# Altium project MDBU017A.PrjPcb (part 1 of 2)
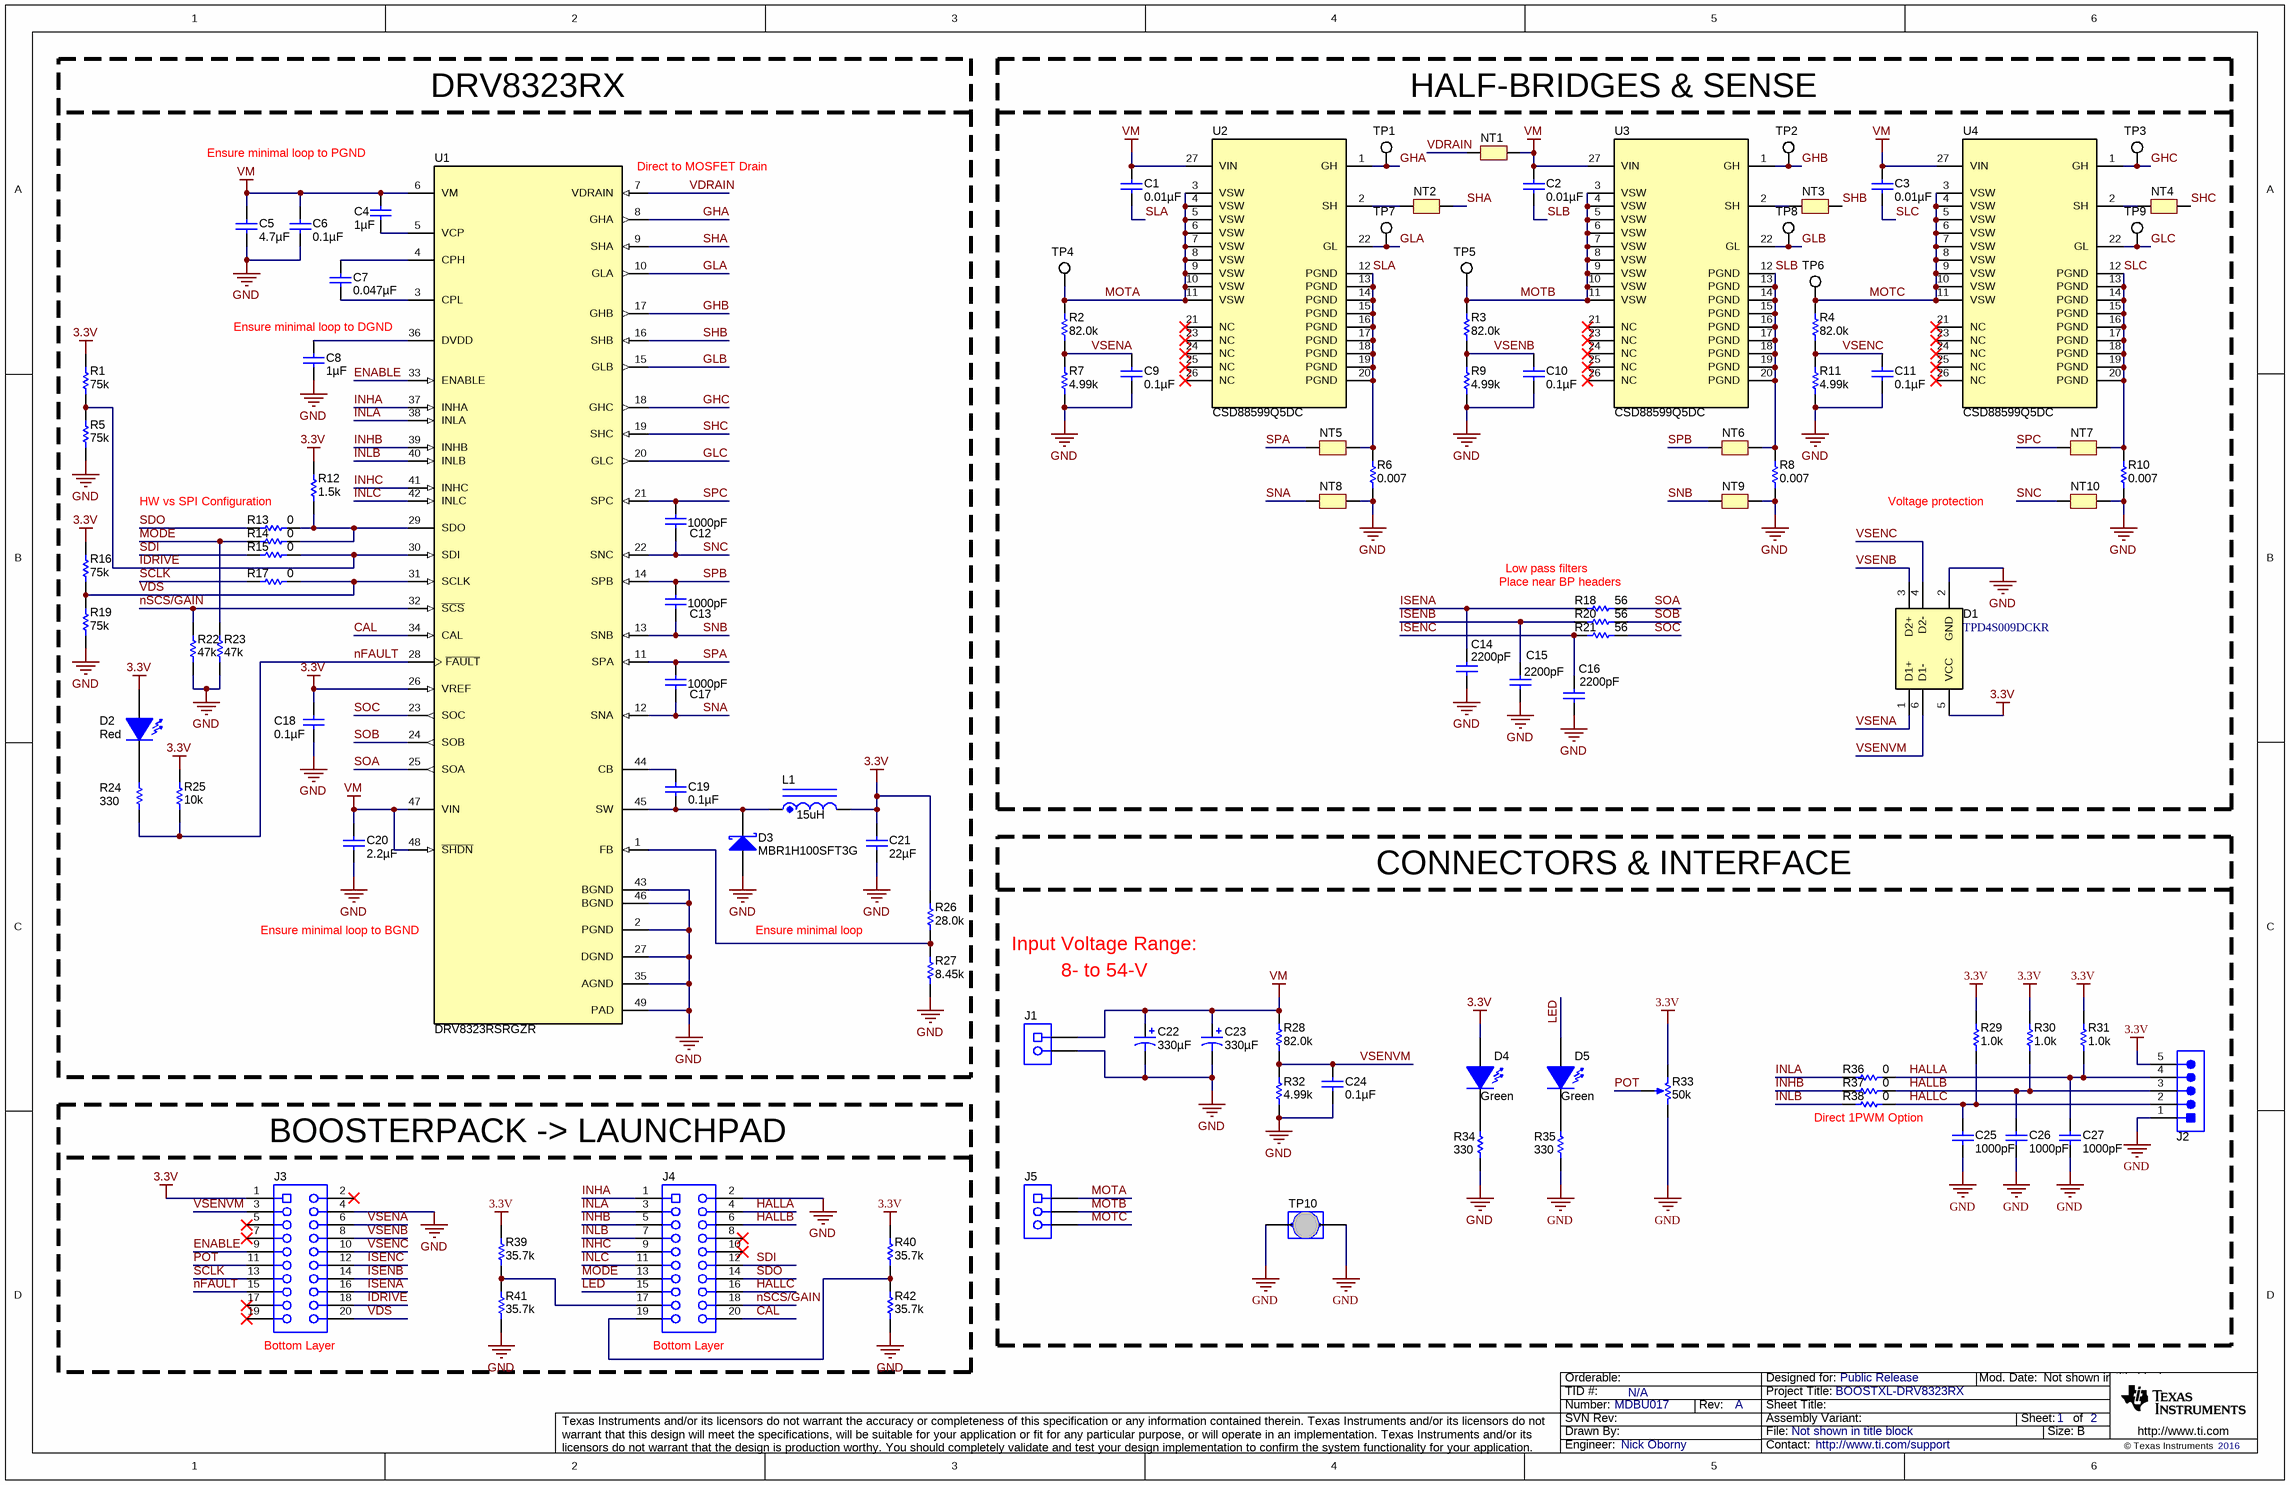
[diagram p0: MDBU017A.SchDoc]
CopyrightYear: 2016; PCB_Layout: Nick Oborny; PCB_Rev: A; PRJ_Customer: Public Release; PRJ_Engineer: Nick Oborny; PRJ_Number: MDBU017; PRJ_Title: BOOSTXL-DRV8323RX; SCH_Rev: A; TechSupport: http://www.ti.com/support; TID: N/A
2 sheets, 117 parts. Net scope: global (net labels, ports and power ports of the same name join across sheets).
Board file: MDBU017A.PcbDoc
Sheets:
  MDBU017A.SchDoc
  MDBU017A_Hardware.SchDoc

## Sheet MDBU017A.SchDoc
size 431 x 279 mm; Date: Not shown in title block; ApprovedBy: Not shown in title block; CheckedBy: Not shown in title block; Author: Not shown in title block; CompanyName: Not shown in title block; Engineer: Not shown in title block; Organization: Not shown in title block; Address1: Not shown in title block; Address2: Not shown in title block; Address3: Not shown in title block; Address4: Not shown in title block; DocumentNumber: 1; Revision: Use project parameter SCH_Rev; SheetNumber: 1; SheetTotal: 2; PageSetup: Record=PageOptions|CenterHorizontal=True|CenterVertical=True|PrintScale=1.00|XCorrection=1.00|YCorrection=1.00|PrintKind=0|BorderSize=5000000|LeftOffset=0|BottomOffset=0|Orientation=2|PaperLength=1000|PaperWidth=1000|Scale=100|PaperSource=15|PrintQuality=600|MediaType=1|DitherType=10|PaperKind=Letter|PrintScaleMode=1; CurrentTime: Not shown in title block; CurrentDate: Not shown in title block; Time: Not shown in title block; DocumentFullPathAndName: Not shown in title block; DocumentName: Not shown in title block; ModifiedDate: Not shown in title block; ImagePath: Not shown in title block

### Parts
C1  ValueDisplayed: 0.01µF  [0603L]  (hidden comment: C0603C103K1RACTU)
C2  ValueDisplayed: 0.01µF  [0603L]  (hidden comment: C0603C103K1RACTU)
C3  ValueDisplayed: 0.01µF  [0603L]  (hidden comment: C0603C103K1RACTU)
C4  ValueDisplayed: 1µF  [0603L]  (hidden comment: 885012206052)
C5  ValueDisplayed: 4.7µF  [1210_270L]  (hidden comment: GRM32ER71K475KE14L)
C6  ValueDisplayed: 0.1µF  [0603L]  (hidden comment: GRM188R72A104KA35D)
C7  ValueDisplayed: 0.047µF  [0603L]  (hidden comment: C1608X7S2A473K080AB)
C8  ValueDisplayed: 1µF  [0603L]  (hidden comment: GRM188R70J105KA01D)
C9  ValueDisplayed: 0.1µF  [0603L]  (hidden comment: C0603C104J4RACTU)
C10  ValueDisplayed: 0.1µF  [0603L]  (hidden comment: C0603C104J4RACTU)
C11  ValueDisplayed: 0.1µF  [0603L]  (hidden comment: C0603C104J4RACTU)
C12  ValueDisplayed: 1000pF  [0603L]  (hidden comment: GRM188R71C102KA01D)
C13  ValueDisplayed: 1000pF  [0603L]  (hidden comment: GRM188R71C102KA01D)
C14  ValueDisplayed: 2200pF  [0603L]  (hidden comment: GRM188R71C222KA01D)
C15  ValueDisplayed: 2200pF  [0603L]  (hidden comment: GRM188R71C222KA01D)
C16  ValueDisplayed: 2200pF  [0603L]  (hidden comment: GRM188R71C222KA01D)
C17  ValueDisplayed: 1000pF  [0603L]  (hidden comment: GRM188R71C102KA01D)
C18  ValueDisplayed: 0.1µF  [0603L]  (hidden comment: GRM188R70J104KA01D)
C19  ValueDisplayed: 0.1µF  [0603L]  (hidden comment: 0603YC104JAT2A)
C20  ValueDisplayed: 2.2µF  [1210L]  (hidden comment: HMK325B7225KN-T)
C21  ValueDisplayed: 22µF  [1206_180L]  (hidden comment: C3216X7S1A226M160AC)
C22  ValueDisplayed: 330µF  [CAPSMT_62_KG5]  (hidden comment: EMVA630ADA331MKG5S)
C23  ValueDisplayed: 330µF  [CAPSMT_62_KG5]  (hidden comment: EMVA630ADA331MKG5S)
C24  ValueDisplayed: 0.1µF  [0603L]  (hidden comment: C0603C104J4RACTU)
C25  ValueDisplayed: 1000pF  [0603L]  (hidden comment: 885012206034)
C26  ValueDisplayed: 1000pF  [0603L]  (hidden comment: 885012206034)
C27  ValueDisplayed: 1000pF  [0603L]  (hidden comment: 885012206034)
D1  TPD4S009DCKR  [DCK0006A_L]
D2  value Red  [LED_LTST-C170]  (hidden comment: LTST-C170KRKT)
D3  MBR1H100SFT3G  [SOD-123FL]
D4  value Green  [LED_LTST-C171]  (hidden comment: LTST-C171GKT)
D5  value Green  [LED_LTST-C171]  (hidden comment: LTST-C171GKT)
J1  691 101 710 002  [Wurth_691101710002]  (value not drawn)
J2  PEC05SAAN  [Sullins_PxC05SAAN]  (value not drawn)
J3  SSQ-110-03-G-D  [Samtec_SSQ-110-03-x-D]  (value not drawn)
J4  SSQ-110-03-G-D  [Samtec_SSQ-110-03-x-D]  (value not drawn)
J5  691 101 710 003  [Wurth_691101710003]  (value not drawn)
L1  value 15uH  [SD53]  (hidden comment: SD53-150-R)
NT1  Net-Tie  [Net-Tie_10mil]  (value not drawn)  (net tie, no BOM)
NT2  Net-Tie  [Net-Tie_10mil]  (value not drawn)  (net tie, no BOM)
NT3  Net-Tie  [Net-Tie_10mil]  (value not drawn)  (net tie, no BOM)
NT4  Net-Tie  [Net-Tie_10mil]  (value not drawn)  (net tie, no BOM)
NT5  Net-Tie  [Net-Tie_10mil]  (value not drawn)  (net tie, no BOM)
NT6  Net-Tie  [Net-Tie_10mil]  (value not drawn)  (net tie, no BOM)
NT7  Net-Tie  [Net-Tie_10mil]  (value not drawn)  (net tie, no BOM)
NT8  Net-Tie  [Net-Tie_10mil]  (value not drawn)  (net tie, no BOM)
NT9  Net-Tie  [Net-Tie_10mil]  (value not drawn)  (net tie, no BOM)
NT10  Net-Tie  [Net-Tie_10mil]  (value not drawn)  (net tie, no BOM)
R1  ValueDisplayed: 75k  [0603L]  (hidden comment: CRCW060375K0JNEA)
R2  ValueDisplayed: 82.0k  [0603L]  (hidden comment: RC0603FR-0782KL)
R3  ValueDisplayed: 82.0k  [0603L]  (hidden comment: RC0603FR-0782KL)
R4  ValueDisplayed: 82.0k  [0603L]  (hidden comment: RC0603FR-0782KL)
R5  ValueDisplayed: 75k  [0603L]  (hidden comment: CRCW060375K0JNEA)
R6  ValueDisplayed: 0.007  [2512L]  (hidden comment: CRE2512-FZ-R007E-3)
R7  ValueDisplayed: 4.99k  [0603L]  (hidden comment: RC0603FR-074K99L)
R8  ValueDisplayed: 0.007  [2512L]  (hidden comment: CRE2512-FZ-R007E-3)
R9  ValueDisplayed: 4.99k  [0603L]  (hidden comment: RC0603FR-074K99L)
R10  ValueDisplayed: 0.007  [2512L]  (hidden comment: CRE2512-FZ-R007E-3)
R11  ValueDisplayed: 4.99k  [0603L]  (hidden comment: RC0603FR-074K99L)
R12  ValueDisplayed: 1.5k  [0603L]  (hidden comment: CRCW06031K50JNEA)
R13  value 0  [0603L]  (hidden comment: CRCW06030000Z0EA)
R14  value 0  [0603L]  (hidden comment: CRCW06030000Z0EA)
R15  value 0  [0603L]  (hidden comment: CRCW06030000Z0EA)
R16  ValueDisplayed: 75k  [0603L]  (hidden comment: CRCW060375K0JNEA)
R17  value 0  [0603L]  (hidden comment: CRCW06030000Z0EA)
R18  value 56  [0603L]  (hidden comment: CRCW060356R0JNEA)
R19  ValueDisplayed: 75k  [0603L]  (hidden comment: CRCW060375K0JNEA)
R20  value 56  [0603L]  (hidden comment: CRCW060356R0JNEA)
R21  value 56  [0603L]  (hidden comment: CRCW060356R0JNEA)
R22  ValueDisplayed: 47k  [0603L]  (hidden comment: CRCW060347K0JNEA)
R23  ValueDisplayed: 47k  [0603L]  (hidden comment: CRCW060347K0JNEA)
R24  value 330  [0603L]  (hidden comment: CRCW0603330RJNEA)
R25  ValueDisplayed: 10k  [0603L]  (hidden comment: CRCW060310K0JNEA)
R26  ValueDisplayed: 28.0k  [0603L]  (hidden comment: CRCW060328K0FKEA)
R27  ValueDisplayed: 8.45k  [0603L]  (hidden comment: CRCW06038K45FKEA)
R28  ValueDisplayed: 82.0k  [0603L]  (hidden comment: RC0603FR-0782KL)
R29  ValueDisplayed: 1.0k  [0603L]  (hidden comment: CRCW06031K00JNEA)
R30  ValueDisplayed: 1.0k  [0603L]  (hidden comment: CRCW06031K00JNEA)
R31  ValueDisplayed: 1.0k  [0603L]  (hidden comment: CRCW06031K00JNEA)
R32  ValueDisplayed: 4.99k  [0603L]  (hidden comment: RC0603FR-074K99L)
R33  value 50k  [Bourns_3352T]  (hidden comment: 3352T-1-503LF)
R34  value 330  [0603L]  (hidden comment: CRCW0603330RJNEA)
R35  value 330  [0603L]  (hidden comment: CRCW0603330RJNEA)
R36  value 0  [0603L]  (hidden comment: CRCW06030000Z0EA)
R37  value 0  [0603L]  (hidden comment: CRCW06030000Z0EA)
R38  value 0  [0603L]  (hidden comment: CRCW06030000Z0EA)
R39  ValueDisplayed: 35.7k  [0603L]  (hidden comment: RC0603FR-0735K7L)
R40  ValueDisplayed: 35.7k  [0603L]  (hidden comment: RC0603FR-0735K7L)
R41  ValueDisplayed: 35.7k  [0603L]  (hidden comment: RC0603FR-0735K7L)
R42  ValueDisplayed: 35.7k  [0603L]  (hidden comment: RC0603FR-0735K7L)
TP1  5002  [Keystone5002]  (value not drawn)
TP2  5002  [Keystone5002]  (value not drawn)
TP3  5002  [Keystone5002]  (value not drawn)
TP4  5002  [Keystone5002]  (value not drawn)
TP5  5002  [Keystone5002]  (value not drawn)
TP6  5002  [Keystone5002]  (value not drawn)
TP7  5002  [Keystone5002]  (value not drawn)
TP8  5002  [Keystone5002]  (value not drawn)
TP9  5002  [Keystone5002]  (value not drawn)
TP10  D3082-05  [Harwin_D3082-05]  (value not drawn)
U1  DRV8323RSRGZR  [RGZ0048B]
U2  CSD88599Q5DC  [DMM0022A]
U3  CSD88599Q5DC  [DMM0022A]
U4  CSD88599Q5DC  [DMM0022A]

### Blocks framed on the sheet
DRV8323RX: C4-C8 C12 C13 C17-C21 D2 D3 L1 R1 R5 R12-R17 R19 R22-R27 U1
HALF-BRIDGES & SENSE: C1-C3 C9-C11 C14-C16 D1 NT1-NT10 R2-R4 R6-R11 R18 R20 R21 TP1-TP9 U2-U4
CONNECTORS & INTERFACE: C22-C27 D4 D5 J1 J2 J5 R28-R38 TP10
BOOSTERPACK -> LAUNCHPAD: J3 J4 R39-R42

### Nets
3.3V: C18.1 C21.1 D1.5(VCC) D2.1(A) D4.1(A) J2.5 J3.1 L1.2 R1.2 R12.2 R16.2 R25.2 R26.2 R29.2 R30.2 R31.2 R33.3(CW) R39.2 R40.2 U1.26(VREF)
GND: C5.2 C6.2 C8.2 C9.2 C10.2 C11.2 C14.2 C15.2 C16.2 C18.2 C20.2 C21.2 C22.2(-) C23.2(-) C24.2 C25.2 C26.2 C27.2 D1.2(GND) D3.2(A) J1.2 J2.1 J3.4 J4.2 NT8.2 NT9.2 NT10.2 R5.1 R6.1 R7.1 R8.1 R9.1 R10.1 R11.1 R19.1 R22.1 R23.1 R27.1 R32.1 R33.1(CCW) R34.1 R35.1 R41.1 R42.1 TP10.1 TP10.2 U1.2(PGND) U1.27(DGND) U1.35(AGND) U1.43(BGND) U1.46(BGND) U1.49(PAD)
VM: C1.1 C2.1 C3.1 C4.1 C5.1 C6.1 C20.1 C22.1(+) C23.1(+) J1.1 NT1.2 R28.2 U1.6(VM) U1.47(VIN) U1.48(~{SHDN}) U2.27(VIN) U3.27(VIN) U4.27(VIN)
CAL: J4.20 U1.34(CAL)
ENABLE: J3.9 U1.33(ENABLE)
GHA: TP1.1 U1.8(GHA) U2.1(GH)
GHB: TP2.1 U1.17(GHB) U3.1(GH)
GHC: TP3.1 U1.18(GHC) U4.1(GH)
GLA: TP7.1 U1.10(GLA) U2.22(GL)
GLB: TP8.1 U1.15(GLB) U3.22(GL)
GLC: TP9.1 U1.20(GLC) U4.22(GL)
HALLA: C27.1 J2.4 J4.4 R31.1 R36.1
HALLB: C26.1 J2.3 J4.6 R30.1 R37.1
HALLC: C25.1 J2.2 J4.16 R29.1 R38.1
IDRIVE: J3.18 R1.1 R5.2 R15.1 U1.30(SDI)
INHA: J4.1 U1.37(INHA)
INHB: J4.5 R37.2 U1.39(INHB)
INHC: J4.9 U1.41(INHC)
INLA: J4.3 R36.2 U1.38(INLA)
INLB: J4.7 R38.2 U1.40(INLB)
INLC: J4.11 U1.42(INLC)
ISENA: C14.1 J3.16 R18.1
ISENB: C15.1 J3.14 R20.1
ISENC: C16.1 J3.12 R21.1
LED: D5.1(A) J4.15
MODE: J4.13 R14.2 R23.2
MOTA: J5.1 R2.2 TP4.1 U2.3(VSW) U2.4(VSW) U2.5(VSW) U2.6(VSW) U2.7(VSW) U2.8(VSW) U2.9(VSW) U2.10(VSW) U2.11(VSW)
MOTB: J5.2 R3.2 TP5.1 U3.3(VSW) U3.4(VSW) U3.5(VSW) U3.6(VSW) U3.7(VSW) U3.8(VSW) U3.9(VSW) U3.10(VSW) U3.11(VSW)
MOTC: J5.3 R4.2 TP6.1 U4.3(VSW) U4.4(VSW) U4.5(VSW) U4.6(VSW) U4.7(VSW) U4.8(VSW) U4.9(VSW) U4.10(VSW) U4.11(VSW)
nFAULT: J3.15 R24.1 R25.1 U1.28(~{FAULT})
nSCS/GAIN: J4.18 R22.2 U1.32(~{SCS})
POT: J3.11 R33.2(WIPER)
SCLK: J3.13 R17.2
SDI: J4.12 R15.2
SDO: J4.14 R13.2
SHA: NT2.2 U1.9(SHA)
SHB: NT3.2 U1.16(SHB)
SHC: NT4.2 U1.19(SHC)
SLA: C1.2 NT5.2 R6.2 U2.12(PGND) U2.13(PGND) U2.14(PGND) U2.15(PGND) U2.16(PGND) U2.17(PGND) U2.18(PGND) U2.19(PGND) U2.20(PGND)
SLB: C2.2 NT6.2 R8.2 U3.12(PGND) U3.13(PGND) U3.14(PGND) U3.15(PGND) U3.16(PGND) U3.17(PGND) U3.18(PGND) U3.19(PGND) U3.20(PGND)
SLC: C3.2 NT7.2 R10.2 U4.12(PGND) U4.13(PGND) U4.14(PGND) U4.15(PGND) U4.16(PGND) U4.17(PGND) U4.18(PGND) U4.19(PGND) U4.20(PGND)
SNA: C17.2 NT8.1 U1.12(SNA)
SNB: C13.2 NT9.1 U1.13(SNB)
SNC: C12.2 NT10.1 U1.22(SNC)
SOA: R18.2 U1.25(SOA)
SOB: R20.2 U1.24(SOB)
SOC: R21.2 U1.23(SOC)
SPA: C17.1 NT5.1 U1.11(SPA)
SPB: C13.1 NT6.1 U1.14(SPB)
SPC: C12.1 NT7.1 U1.21(SPC)
VDRAIN: NT1.1 U1.7(VDRAIN)
VDS: J3.20 R16.1 R17.1 R19.2 U1.31(SCLK)
VSENA: C9.1 D1.1(D1+) J3.6 R2.1 R7.2
VSENB: C10.1 D1.3(D2+) J3.8 R3.1 R9.2
VSENC: C11.1 D1.4(D2-) J3.10 R4.1 R11.2
VSENVM: C24.1 D1.6(D1-) J3.3 R28.1 R32.2
NetC4_2: C4.2 U1.5(VCP)
NetC7_1: C7.1 U1.4(CPH)
NetC7_2: C7.2 U1.3(CPL)
NetC8_1: C8.1 U1.36(DVDD)
NetC19_1: C19.1 U1.44(CB)
NetC19_2: C19.2 D3.1(K) L1.1 U1.45(SW)
NetD2_2: D2.2(K) R24.2
NetD4_2: D4.2(K) R34.2
NetD5_2: D5.2(K) R35.2
NetJ4_17: J4.17 R39.1 R41.2
NetJ4_19: J4.19 R40.1 R42.2
NetNT2_1: NT2.1 U2.2(SH)
NetNT3_1: NT3.1 U3.2(SH)
NetNT4_1: NT4.1 U4.2(SH)
NetR12_1: R12.1 R13.1 R14.1 U1.29(SDO)
NetR26_1: R26.1 R27.2 U1.1(FB)

Not connected (* = marked no-connect by the designer): J3 2* 5* 7* 17* 19*; J4 8* 10*; U2 21(NC)* 23(NC)* 24(NC)* 25(NC)* 26(NC)*; U3 21(NC)* 23(NC)* 24(NC)* 25(NC)* 26(NC)*; U4 21(NC)* 23(NC)* 24(NC)* 25(NC)* 26(NC)*

### Notes on the sheet
- Ensure minimal loop to PGND
- (near U1) Direct to MOSFET Drain
- Ensure minimal loop to DGND
- HW vs SPI Configuration
- Voltage protection
- Low pass filters
- Place near BP headers
- (near U1) Ensure minimal loop to BGND
- Ensure minimal loop
- Input Voltage Range:
- 8- to 54-V
- (near R38) Direct 1PWM Option
- (near J3) Bottom Layer
- (near J4) Bottom Layer
- Drawn By:
- SVN Rev:
- Number:
- TID #:
- Orderable:
- Rev:
- Sheet Title:
- File:
- Project Title:
- Designed for:
- Assembly Variant:
- Mod. Date:
- Sheet:
- Size:
- of
- B
- http://www.ti.com
- Texas Instruments and/or its licensors do not warrant the accuracy or completeness of this specification or any information contained therein. Texas Instruments and/or its licensors do not warrant that this design will meet the specifications, will be suitable for your application or fit for any particular purpose, or will operate in an implementation. Texas Instruments and/or its licensors do not warrant that the design is production worthy. You should completely validate and test your design implementation to confirm the system functionality for your application.
- Engineer:
- Contact:
- © Texas Instruments

### Library data of the parts
C1-C3 = C0603C103K1RACTU: CAP, CERM, 0.01 µF, 100 V, +/- 10%, X7R, 0603; Manufacturer: Kemet; Polarized: N; CompType: Capacitor; Value: 0.01uF; U/M: EA; Cap_F: 0.00000001; Tolerance_%: 10; Value1: Unknown; VDC_V: 100; Value2: 100V; TaMin_C: -55; TaMax_C: 125; Cap_Case: 0603; AEC Category: Q200; SizeArea_mm2: 1.28; SizeAreaWB_mm2: 4.68; SizeX_mm: 1.6; SizeY_mm: 0.8; SizeZ_mm: 1; SymbolVersion: 2008-07-09; PartNumber: C0603C103K1RACTU; PackageReference: 0603; RoHS: Y; MountType: SMT; Technology: Ceramic; TempCo: X7R; Published: 2008-06-19; Publisher: Texas Instruments; LatestRevisionDate: 2016-12-05; ComponentLink1Description: Datasheet link; ComponentLink1URL: http://www.kemet.com/kemet/web/homepage/kechome.nsf/vapubfiles/F3102_Y5V.pdf/$file/F3102_Y5V.pdf; Supplier 1: Mouser; Supplier Part Number 1: 80-C0603C103K1R; Supplier 2: Farnell; Supplier Part Number 2: 1865545; AEC Qualified: ?
C4 = 885012206052: CAP, CERM, 1 µF, 16 V, +/- 10%, X7R, 0603; Manufacturer: Wurth Elektronik; Polarized: N; CompType: Capacitor; Value: 1uF; U/M: EA; Cap_F: 0.000001; Tolerance_%: 10; Value1: Unknown; VDC_V: 16; Value2: 16V; TaMin_C: -55; TaMax_C: 125; Cap_Case: 0603; AEC Category: Q200; SymbolVersion: 2008-07-09; PartNumber: 885012206052; PackageReference: 0603; RoHS: Y; MountType: SMT; Technology: Ceramic; TempCo: X7R; Published: 2008-06-19; Publisher: Texas Instruments; LatestRevisionDate: 2016-03-19; ComponentLink1Description: Datasheet link; ComponentLink1URL: http://katalog.we-online.de/pbs/datasheet/885012206052.pdf; Supplier 1: Mouser; Supplier Part Number 1: 710-885012206052; AEC Qualified: N; AEC Grade: N/A
C5 = GRM32ER71K475KE14L: CAP, CERM, 4.7 µF, 80 V, +/- 10%, X7R, 1210; Manufacturer: MuRata; Polarized: N; CompType: Capacitor; Value: 4.7uF; U/M: EA; Cap_F: 0.0000047; Tolerance_%: 10; Value1: Unknown; VDC_V: 80; Value2: 80V; TaMin_C: -55; TaMax_C: 125; Cap_Case: 1210; AEC Category: Q200; SizeArea_mm2: 8; SizeAreaWB_mm2: 14.7; SizeX_mm: 3.2; SizeY_mm: 2.5; SizeZ_mm: 2.7; SymbolVersion: 2008-07-09; PartNumber: GRM32ER71K475KE14L; PackageReference: 1210; RoHS: Y; MountType: SMT; Technology: Ceramic; TempCo: X7R; Published: 2008-06-19; Publisher: Texas Instruments; LatestRevisionDate: 2016-12-05; ComponentLink1Description: Datasheet link; ComponentLink1URL: http://psearch.en.murata.com/capacitor/product/GRM32ER71K475KE14%23.pdf; Supplier 1: Digi-Key; Supplier Part Number 1: 490-9972-1-ND; Supplier 2: Mouser; Supplier Part Number 2: 81-GRM32ER71K475KE4L; AEC Qualified: N; AEC Grade: N/A
C6 = GRM188R72A104KA35D: CAP, CERM, 0.1 µF, 100 V, +/- 10%, X7R, 0603; Manufacturer: MuRata; Polarized: N; CompType: Capacitor; Value: 0.1uF; U/M: EA; Cap_F: 0.0000001; Tolerance_%: 10; Value1: Unknown; VDC_V: 100; Value2: 100V; TaMin_C: -55; TaMax_C: 125; Cap_Case: 0603; AEC Category: Q200; SymbolVersion: 2008-07-09; PartNumber: GRM188R72A104KA35D; PackageReference: 0603; RoHS: Y; MountType: SMT; Technology: Ceramic; TempCo: X7R; Published: 2008-06-19; Publisher: Texas Instruments; LatestRevisionDate: 2016-03-19; ComponentLink1Description: Datasheet link; ComponentLink1URL: http://search.murata.co.jp/Ceramy/PnsearchViewAction.do?HnOFG=ON&HnNFG=ON&SEL_CNT=50&sLang=en&sKey=GRM188R72A104KA35D&x=9&y=9&search=startwith; Supplier 1: Digi-Key; Supplier Part Number 1: 490-3285-1-ND; Supplier 2: Mouser; Supplier Part Number 2: 81-GRM188R72A104KA35; Supplier 3: Farnell; Supplier Part Number 3: 1828921; AEC Qualified: ?
C7 = C1608X7S2A473K080AB: CAP, CERM, 0.047 µF, 100 V, +/- 10%, X7S, 0603; Manufacturer: TDK; Polarized: N; CompType: Capacitor; Value: 0.047uF; U/M: EA; Cap_F: 0.000000047; Tolerance_%: 10; ESR_ohm: 0.089796; Value1: 0.089796 ohm; VDC_V: 100; Value2: 100V; IRMS_A: 0.567484; TaMin_C: -55; TaMax_C: 125; Cap_Case: 0603; AEC Category: Q200; SizeArea_mm2: 1.28; SizeAreaWB_mm2: 4.68; SizeX_mm: 1.6; SizeY_mm: 0.8; SizeZ_mm: 1; SymbolVersion: 2008-07-09; PartNumber: C1608X7S2A473K080AB; PackageReference: 0603; RoHS: Y; MountType: SMT; Technology: Ceramic; TempCo: X7S; Published: 2008-06-19; Publisher: Texas Instruments; LatestRevisionDate: 2016-12-05; ComponentLink1Description: Datasheet link; ComponentLink1URL: https://product.tdk.com/en/search/capacitor/ceramic/mlcc/info?part_no=C1608X7S2A473K080AB; Supplier 1: Digi-Key; Supplier Part Number 1: 445-6032-1-ND; Supplier 2: Mouser; Supplier Part Number 2: 810-C1608X7S2A473K080AB; AEC Qualified: N; AEC Grade: N/A
C8 = GRM188R70J105KA01D: CAP, CERM, 1 µF, 6.3 V, +/- 10%, X7R, 0603; Manufacturer: MuRata; Polarized: N; CompType: Capacitor; Value: 1uF; U/M: EA; Cap_F: 0.000001; Tolerance_%: 10; Value1: Unknown; VDC_V: 6.3; Value2: 6.3V; TaMin_C: -55; TaMax_C: 125; Cap_Case: 0603; AEC Category: Q200; SymbolVersion: 2008-07-09; PartNumber: GRM188R70J105KA01D; PackageReference: 0603; RoHS: Y; MountType: SMT; Technology: Ceramic; TempCo: X7R; Published: 2008-06-19; Publisher: Texas Instruments; LatestRevisionDate: 2016-03-19; ComponentLink1Description: Datasheet link; ComponentLink1URL: http://search.murata.co.jp/Ceramy/PnsearchViewAction.do?HnOFG=ON&HnNFG=ON&SEL_CNT=50&sLang=en&sKey=GRM188R70J105KA01D&x=9&y=9&search=startwith; Supplier 1: Digi-Key; Supplier Part Number 1: 490-3898-1-ND; Supplier 2: Mouser; Supplier Part Number 2: 81-GRM188R70J105KA01; Supplier 3: Farnell; Supplier Part Number 3: 1845765; AEC Qualified: ?
C9-C11 C24 = C0603C104J4RACTU: CAP, CERM, 0.1 µF, 16 V, +/- 5%, X7R, 0603; Manufacturer: Kemet; Polarized: N; CompType: Capacitor; Value: 0.1uF; U/M: EA; Cap_F: 0.0000001; Tolerance_%: 5; Value1: Unknown; VDC_V: 16; Value2: 16V; TaMin_C: -55; TaMax_C: 125; Cap_Case: 0603; SymbolVersion: 2008-07-09; PartNumber: C0603C104J4RACTU; PackageReference: 0603; RoHS: Y; MountType: SMT; Technology: Ceramic; TempCo: X7R; Published: 2008-06-19; Publisher: Texas Instruments; LatestRevisionDate: 2015-01-29; ComponentLink1Description: Datasheet link; ComponentLink1URL: http://www.kemet.com/kemet/web/homepage/kechome.nsf/vapubfiles/F3102_Y5V.pdf/$file/F3102_Y5V.pdf; Supplier 1: Digi-Key; Supplier Part Number 1: 399-1097-1-ND; Supplier 2: Mouser; Supplier Part Number 2: 80-C0603C104J4R; Supplier 3: Farnell; Supplier Part Number 3: 1650834
C12 C13 C17 = GRM188R71C102KA01D: CAP, CERM, 1000pF, 16V, +/-10%, X7R, 0603; Manufacturer: MuRata; Polarized: N; CompType: Capacitor; U/M: EA; Cap_F: 0.000000001; Tolerance_%: 10; Value1: Unknown; VDC_V: 16; TaMin_C: -55; TaMax_C: 125; Cap_Case: 0603; SymbolVersion: 2008-07-09; Value: 1000pF; PartNumber: GRM188R71C102KA01D; PackageReference: 0603; RoHS: Y; Value2: 16V; MountType: SMT; Technology: Ceramic; TempCo: X7R; Published: 2008-06-19; Publisher: Texas Instruments; LatestRevisionDate: 2014-07-08; ComponentLink1Description: Datasheet link; ComponentLink1URL: http://search.murata.co.jp/Ceramy/PnsearchViewAction.do?HnOFG=ON&HnNFG=ON&SEL_CNT=50&sLang=en&sKey=GRM188R71C102KA01D&x=9&y=9&search=startwith; Supplier 1: Digi-Key; Supplier Part Number 1: GRM188R71C102KA01D-ND; Supplier 2: Mouser; Supplier Part Number 2: 81-GRM188R71C102KA1D
C14-C16 = GRM188R71C222KA01D: CAP, CERM, 2200pF, 16V, +/-10%, X7R, 0603; Manufacturer: MuRata; Polarized: N; CompType: Capacitor; U/M: EA; Cap_F: 0.0000000022; Tolerance_%: 10; Value1: Unknown; VDC_V: 16; TaMin_C: -55; TaMax_C: 125; Cap_Case: 0603; SymbolVersion: 2008-07-09; Value: 2200pF; PartNumber: GRM188R71C222KA01D; PackageReference: 0603; RoHS: Y; Value2: 16V; MountType: SMT; Technology: Ceramic; TempCo: X7R; Published: 2008-06-19; Publisher: Texas Instruments; LatestRevisionDate: 2014-02-11; ComponentLink1Description: Datasheet link; ComponentLink1URL: http://search.murata.co.jp/Ceramy/PnsearchViewAction.do?HnOFG=ON&HnNFG=ON&SEL_CNT=50&sLang=en&sKey=GRM188R71C222KA01D&x=9&y=9&search=startwith; Supplier 1: Digi-Key; Supplier Part Number 1: GRM188R71C222KA01D-ND; Supplier 2: Mouser; Supplier Part Number 2: 81-GRM188R71C222KA1D
C18 = GRM188R70J104KA01D: CAP, CERM, 0.1 µF, 6.3 V, +/- 10%, X7R, 0603; Manufacturer: MuRata; Polarized: N; CompType: Capacitor; Value: 0.1uF; U/M: EA; Cap_F: 0.0000001; Tolerance_%: 10; Value1: Unknown; VDC_V: 6.3; Value2: 6.3V; TaMin_C: -55; TaMax_C: 125; Cap_Case: 0603; AEC Category: Q200; SymbolVersion: 2008-07-09; PartNumber: GRM188R70J104KA01D; PackageReference: 0603; RoHS: Y; MountType: SMT; Technology: Ceramic; TempCo: X7R; Published: 2008-06-19; Publisher: Texas Instruments; LatestRevisionDate: 2016-03-19; ComponentLink1Description: Datasheet link; ComponentLink1URL: http://search.murata.co.jp/Ceramy/PnsearchViewAction.do?HnOFG=ON&HnNFG=ON&SEL_CNT=50&sLang=en&sKey=GRM188R70J104KA01D&x=9&y=9&search=startwith; Supplier 1: Digi-Key; Supplier Part Number 1: GRM188R70J104KA01D-ND; Supplier 2: Mouser; Supplier Part Number 2: 81-GRM188R70J104KA1D; AEC Qualified: ?
C19 = 0603YC104JAT2A: CAP, CERM, 0.1 µF, 16 V, +/- 5%, X7R, 0603; Manufacturer: AVX; Polarized: N; CompType: Capacitor; Value: 0.1uF; U/M: EA; Cap_F: 0.0000001; Tolerance_%: 5; ESR_ohm: 0.039; Value1: 0.039 ohm; VDC_V: 16; Value2: 16V; TaMin_C: -55; TaMax_C: 125; Cap_Case: 0603; AEC Category: Q200; SymbolVersion: 2008-07-09; PartNumber: 0603YC104JAT2A; PackageReference: 0603; RoHS: Y; MountType: SMT; Technology: Ceramic; TempCo: X7R; Published: 2008-06-19; Publisher: Texas Instruments; LatestRevisionDate: 2016-03-19; ComponentLink1Description: Datasheet link; ComponentLink1URL: http://datasheets.avx.com/X7RDielectric.pdf; Supplier 1: Digi-Key; Supplier Part Number 1: 478-3726-1-ND; Supplier 2: Mouser; Supplier Part Number 2: 581-0603YC104J; Supplier 3: Farnell; Supplier Part Number 3: 1740612; AEC Qualified: N; AEC Grade: N/A
C20 = HMK325B7225KN-T: CAP, CERM, 2.2 µF, 100 V, +/- 10%, X7R, 1210; Manufacturer: Taiyo Yuden; Polarized: N; CompType: Capacitor; Value: 2.2uF; U/M: EA; Cap_F: 0.0000022; Tolerance_%: 10; Value1: Unknown; VDC_V: 100; Value2: 100V; TaMin_C: -55; TaMax_C: 125; Cap_Case: 1210; AEC Category: Q200; SizeArea_mm2: 8; SizeAreaWB_mm2: 14.7; SizeX_mm: 3.2; SizeY_mm: 2.5; SizeZ_mm: 1.35; SymbolVersion: 2008-07-09; PartNumber: HMK325B7225KN-T; PackageReference: 1210; RoHS: Y; MountType: SMT; Technology: Ceramic; TempCo: X7R; Published: 2008-06-19; Publisher: Texas Instruments; LatestRevisionDate: 2016-12-05; ComponentLink1Description: Datasheet link; ComponentLink1URL: http://www.yuden.co.jp/ut/product/pdf/dhmk_e.pdf; Supplier 1: Digi-Key; Supplier Part Number 1: 587-1778-1-ND; Supplier 2: Farnell; Supplier Part Number 2: 1735547; Supplier 3: Newark; Supplier Part Number 3: 08P5140; AEC Qualified: ?
C21 = C3216X7S1A226M160AC: CAP, CERM, 22 µF, 10 V, +/- 20%, X7S, 1206; Manufacturer: TDK; Polarized: N; CompType: Capacitor; Value: 22uF; U/M: EA; Cap_F: 0.000022; Tolerance_%: 20; ESR_ohm: 0.002398; Value1: 0.002398 ohm; VDC_V: 10; Value2: 10V; IRMS_A: 4.68507; TaMin_C: -55; TaMax_C: 125; Cap_Case: 1206_180; SizeArea_mm2: 5.12; SizeAreaWB_mm2: 10.92; SizeX_mm: 3.2; SizeY_mm: 1.6; SizeZ_mm: 1.8; AEC Category: Q200; SymbolVersion: 2008-07-09; PartNumber: C3216X7S1A226M160AC; PackageReference: 1206; RoHS: Y; MountType: SMT; Technology: Ceramic; TempCo: X7S; Published: 2008-06-19; Publisher: Texas Instruments; LatestRevisionDate: 2016-12-05; ComponentLink1Description: Datasheet link; ComponentLink1URL: https://product.tdk.com/en/search/capacitor/ceramic/mlcc/info?part_no=C3216X7S1A226M160AC; Supplier 1: Digi-Key; Supplier Part Number 1: 445-8035-1-ND; Supplier 2: Mouser; Supplier Part Number 2: 810-C3216X7S1A226M160AC; AEC Qualified: N; AEC Grade: N/A
C22 C23 = EMVA630ADA331MKG5S: CAP, AL, 330 µF, 63 V, +/- 20%, SMD; Manufacturer: Chemi-Con; Polarized: Y; CompType: Capacitor; Value: 330uF; U/M: EA; Cap_F: 0.00033; Tolerance_%: 20; Value1: Unknown; VDC_V: 63; Value2: 63V; IRMS_A: 0.72; TaMin_C: -40; TaMax_C: 85; Cap_Case: 12.5x16mm; AEC Category: Q200; AEC Qualified: N; SymbolVersion: 2008-07-09; PartNumber: EMVA630ADA331MKG5S; PackageReference: KG5; RoHS: Y; MountType: SMT; Technology: AL; Series: MVA; Publisher: Texas Instruments; LatestRevisionDate: 2016-05-12; ComponentLink1Description: Datasheet link; ComponentLink1URL: http://www.chemi-con.co.jp/cgi-bin/CAT_DB/SEARCH/cat_db_al.cgi?e=e&j=p&pdfname=mva; Supplier 1: Digi-Key; Supplier Part Number 1: 565-2156-1-ND; AEC Grade: N/A
C25-C27 = 885012206034: CAP, CERM, 1000 pF, 16 V, +/- 10%, X7R, 0603; Manufacturer: Wurth Elektronik; Polarized: N; CompType: Capacitor; Value: 1000pF; U/M: EA; Cap_F: 0.000000001; Tolerance_%: 10; Value1: Unknown; VDC_V: 16; Value2: 16V; TaMin_C: -55; TaMax_C: 125; Cap_Case: 0603; AEC Category: Q200; SymbolVersion: 2008-07-09; PartNumber: 885012206034; PackageReference: 0603; RoHS: Y; MountType: SMT; Technology: Ceramic; TempCo: X7R; Published: 2008-06-19; Publisher: Texas Instruments; LatestRevisionDate: 2016-03-19; ComponentLink1Description: Datasheet link; ComponentLink1URL: http://katalog.we-online.de/pbs/datasheet/885012206034.pdf; Supplier 1: Mouser; Supplier Part Number 1: 710-885012206034; AEC Qualified: N; AEC Grade: N/A
D1 = TPD4S009DCKR: ESD Solution for High-Speed Differential Interface, 4 Channels, -40 to +85 degC, 6-pin SC70 (DCK), Green (RoHS & no Sb/Br); Manufacturer: Texas Instruments; Alternate PartNumber: Equivalent; Breakdown Voltage(Min)(V): 9; Differential Capacitance(pF): 0.05; IEC 61000-4-2 Contact(+/- kV): 8; IO Capacitance(Typ)(pF): 0.8; IO Leakage Current(nA): 10; PartNumber: TPD4S009DCKR; MountType: SMT; ComponentLink1Description: Datasheet; ComponentLink1URL: http://www.ti.com/general/docs/lit/getliterature.tsp?genericPartNumber=TPD4S009&fileType=pdf; PackageReference: DCK0006A; Alternate Manufacturer: Texas Instruments; Supplier 1: Digi-Key; Supplier Part Number 1: 296-24471-2-ND; Supplier 2: Digi-Key; Supplier Part Number 2: 296-24471-1-ND; DatasheetVersion: SLVS817E; PackageVersion: revG, Jan-2007; PackageDescription: 6-Pin Plastic Small-Outline Package, 2 x 1.3 mm Body, 0.65 mm Pitch, 2.1 mm Lead Span; Eco-Plan: Green (RoHS & no Sb/Br); IEC 61000-4-2 Air-Gap(+/- kV): 9; SubFamily: ESD Solution; Code_JEDEC: MO-203-AB; ComponentLink2Description: URL Link1; ComponentLink2URL: SamplesURL:http://www.ti.com/product/tpd4s009#samples; Supplier 3: Digi-Key; Supplier Part Number 3: 296-24471-6-ND; Supplier 4: Mouser; Supplier Part Number 4: 595-TPD4S009DCKR
D2 = LTST-C170KRKT: LED, Red, SMD; Manufacturer: Lite-On; Type: AlInGaP; Vf_V: 2; Value2: 2V; Io_A: 20; Value1: W; U/M: EA; CompType: LED; PartNumber: LTST-C170KRKT; SymbolVersion: 2008-12-08; MountType: SMT; RoHS: Y; PackageReference: LED_0805; Color: red; Published: 2008-07-11; Publisher: Texas Instruments; ComponentLink1URL: http://optoelectronics.liteon.com/en-us/api/DwonloadFileHandler.ashx?txtSpecNo=DS-22-99-0150&txtPartNo=LTST-C170KRKT; ComponentLink1Description: Datasheet link; LatestRevisionDate: 2013-09-07; Supplier 1: Digi-Key; Supplier Part Number 1: 160-1415-1-ND; Supplier 2: Mouser; Supplier Part Number 2: 859-LTST-C170KRKT
D3 = MBR1H100SFT3G: Diode, Schottky, 100 V, 1 A, SOD-123FL; Manufacturer: ON Semiconductor; U/M: EA; Vf_V: 0.76; Value: 100V; Value1: 1A; Value2: 0.76V; Io_A: 1; Vr_V: 100; TJmax_C: 175; RJC_CperW: 85; AEC Category: Q101; SizeAreaWB_mm2: 12.19; SizeArea_mm2: 5.94; SizeX_mm: 3.6; SizeY_mm: 1.65; SizeZ_mm: 0.98; CompType: Diode; SymbolVersion: 2008-12-08; PartNumber: MBR1H100SFT3G; PackageReference: SOD-123FL; MountType: SMT; Type: Schottky; RoHS: Y; Published: 2008-06-26; Publisher: Texas Instruments; LatestRevisionDate: 2016-12-06; ComponentLink1Description: Datasheet link; ComponentLink1URL: http://www.onsemi.com/pub_link/Collateral/MBR1H100SF-D.PDF; Supplier 1: Digi-Key; Supplier Part Number 1: MBR1H100SFT3GOSCT-ND; Supplier 2: Mouser; Supplier Part Number 2: 863-MBR1H100SFT3G; AEC Qualified: ?
D4 D5 = LTST-C171GKT: LED, Green, SMD; Manufacturer: Lite-On; Type: AlInGaP; Vf_V: 2.1; Value2: 2.1V; Io_A: 20; Value1: W; U/M: EA; CompType: LED; PartNumber: LTST-C171GKT; SymbolVersion: 2008-12-08; MountType: SMT; RoHS: Y; PackageReference: LED_0805; Color: green; Published: 2008-07-11; Publisher: Texas Instruments; ComponentLink1URL: https://sps06.itg.ti.com/sites/KMS/crossdivteams/altium/docs/ComponentDatasheets/LTST-C171GKT.pdf; ComponentLink1Description: Datasheet link; Supplier 1: Digi-Key; Supplier Part Number 1: 160-1423-1-ND; Supplier 2: Mouser; Supplier Part Number 2: 859-LTST-C171GKT
  D4: LatestRevisionDate: 2013-09-07
  D5: LatestRevisionDate: 2015-12-18
J1 = 691 101 710 002: Terminal Block, 5 mm, 2x1, Tin, TH; Manufacturer: Wurth Elektronik eiSos; SymbolCreator: a0412235; U/M: EA; SymbolVersion: 2013-09-04; PartNumber: 691 101 710 002; PackageReference: Terminal Block, 5 mm, 2x1, TH; CompType: Terminal Block; RoHS: Y; MountType: TH; ComponentLink1Description: Datasheet Link; ComponentLink1URL: http://katalog.we-online.de/em/datasheet/6911017100xx.pdf; Publisher: Texas Instruments; LatestRevisionDate: 2015-02-03; Supplier 1: Digi-Key; Supplier Part Number 1: 732-2026-ND; Supplier 2: Mouser; Supplier Part Number 2: 710-691101710002
J2 = PEC05SAAN: Header, 2.54mm, 5x1, Tin, TH; Manufacturer: Sullins Connector Solutions; SymbolCreator: a0412235; Pitch_mm: 2.54; Gender: Male; Shrouded: N; Row_Count: 1; Current_A: 3; Voltage_V: 1800; Cert_UL: Y; SymbolVersion: 2013-12-22; PartNumber: PEC05SAAN; PackageReference: Header, 2.54mm, 5x1, TH; ClassName: Header; CompType: Header; RoHS: Y; MountType: TH; ComponentLink1Description: Datasheet URL; ComponentLink1URL: http://www.sullinscorp.com/catalogs/77_PAGE108-109_.100_MALE_HDR.pdf; Orientation: Vertical; PinCount: 5; ContactFinish: Tin; Color: Black; Publisher: Texas Instruments; LatestRevisionDate: 2016-03-04; Supplier 1: Digi-Key; Supplier Part Number 1: S1012E-05-ND
J3 J4 = SSQ-110-03-G-D: Receptacle, 2.54mm, 10x2, Gold, TH; Manufacturer: Samtec; SymbolCreator: a0412235; Pitch_mm: 2.54; Gender: Female; Row_Count: 2; Current_A: 6.3; Voltage_V: 550; Cert_CSA: Y; Cert_CULUS: N; SymbolVersion: 2013-12-20; PartNumber: SSQ-110-03-G-D; PackageReference: Receptacle, 2.54mm, 10x2, TH; CompType: Receptacle; RoHS: Y; MountType: TH; ComponentLink1Description: Datasheet URL; ComponentLink1URL: https://www.samtec.com/ftppub/cpdf/SSQ-1XX-XX-XXX-X-XX-XXX-XX-X-MKT.pdf; Orientation: Vertical; PinCount: 20; RowSpacing_mm: 2.54; ContactFinish: Gold; Color: Black; Cert_UL: Y; Cert_VDE: N; Publisher: Texas Instruments; LatestRevisionDate: 2016-03-21
J5 = 691 101 710 003: Terminal Block, 5 mm, 3x1, Tin, TH; Manufacturer: Wurth Elektronik eiSos; SymbolCreator: a0412235; U/M: EA; SymbolVersion: 2013-10-03; PartNumber: 691 101 710 003; PackageReference: Terminal Block, 5 mm, 3x1, TH; CompType: Terminal Block; RoHS: Y; MountType: TH; ComponentLink1Description: Datasheet Link; ComponentLink1URL: http://katalog.we-online.de/em/datasheet/6911017100xx.pdf; Publisher: Texas Instruments; LatestRevisionDate: 2015-02-03; Supplier 1: Digi-Key; Supplier Part Number 1: 732-2027-ND; Supplier 2: Mouser; Supplier Part Number 2: 710-691101710003
L1 = SD53-150-R: Inductor, Shielded Drum Core, Ferrite, 15 µH, 1.1 A, 0.122 ohm, SMD; Manufacturer: Cooper Bussman; SymbolCreator: a0412235; Ind_H: 15.0E-6; ValueDisplayed: 15µH; Imax_A: 1.1; Irms: 1.1A @ 40C rise; Isat: 1.1A @ 30% inductance drop; DCR_ohm: 0.122; Value2: 1.1A; SymbolVersion: 2013-02-25; PartNumber: SD53-150-R; CompType: Inductor; Value1: 0.122 ohm; Technology: Shielded Drum Core; MountType: SMT; Material: Ferrite; PackageReference: 5.72x3x5.2mm; Published: 2008-06-26; Publisher: Texas Instruments; LatestRevisionDate: 2015-02-09; ComponentLink1Description: Datasheet link; ComponentLink1URL: http://www.cooperindustries.com/content/dam/public/bussmann/Electronics/Resources/Data%20Sheets/Bus_Elx_DS_PM%204149_SD53_Series.pdf; RoHS: Y; Supplier 1: Digi-Key; Supplier Part Number 1: 513-1458-1-ND; Supplier 2: Mouser; Supplier Part Number 2: 704-SD53-150-R; Supplier 3: Newark; Supplier Part Number 3: 99M5528
NT1-NT10 = Net-Tie: Single point connection between nets.; SymbolCreator: codlsc; SymbolVersion: 2009-07-01; MountType: SMT; PackageReference: N/A; Publisher: Texas Instruments; LatestRevisionDate: 2014-12-30; LatestRevisionNote: Added Alternate PartNumber and Alternate Manufacturer parameters to appropriate components.
R1 R5 R16 R19 = CRCW060375K0JNEA: RES, 75 k, 5%, 0.1 W, 0603; Manufacturer: Vishay-Dale; CompType: Resistor; Value: 75k; Res_ohm: 75000; Value_Code: 75k0; Tolerance_%: 5; Power_W: 0.1; Value2: 0.1W; VDC_V: 75; TempCo: 200 ppm/C; EIA_Code: E24; U/M: EA; AEC Category: Q200; SymbolVersion: 2009-05-29; PartNumber: CRCW060375K0JNEA; PackageReference: 0603; RoHS: Y; Value1: 5%; MountType: SMT; Technology: Thick Film; Published: 2008-06-26; Publisher: Texas Instruments; LatestRevisionDate: 2016-03-05; ComponentLink1Description: Datasheet link; ComponentLink1URL: http://www.vishay.com/docs/20035/dcrcwe3.pdf; Supplier 1: Digi-Key; Supplier Part Number 1: 541-75KGCT-ND; Supplier 2: Mouser; Supplier Part Number 2: 71-CRCW0603J-75K-E3; Supplier 3: Farnell; Supplier Part Number 3: 1570763; AEC Qualified: ?
R2-R4 R28 = RC0603FR-0782KL: RES, 82.0 k, 1%, 0.1 W, 0603; Manufacturer: Yageo America; CompType: Resistor; Value: 82.0k; Res_ohm: 82000; Value_Code: 82k0; Tolerance_%: 1; Power_W: 0.1; Value2: 0.1W; VDC_V: 150; TempCo: 200 ppm/C; U/M: EA; AEC Category: Q200; SymbolVersion: 2009-05-29; PartNumber: RC0603FR-0782KL; PackageReference: 0603; RoHS: Y; Value1: 1%; MountType: SMT; Technology: Thick Film; Published: 2008-06-26; Publisher: Texas Instruments; LatestRevisionDate: 2016-03-05; ComponentLink1Description: Datasheet link; ComponentLink1URL: http://www.yageo.com/pdf/Pu-RC0603_51_PbFree_L_2.pdf; Supplier 1: Digi-Key; Supplier Part Number 1: 311-82.0KHRCT-ND; Supplier 2: Mouser; Supplier Part Number 2: 603-RC0603FR-0782KL; Supplier 3: Farnell; Supplier Part Number 3: 9238719; AEC Qualified: ?
R6 R8 R10 = PMR100HZPFU7L00: RES SMD 0.007 OHM 1% 3W 2512; Manufacturer: Bourns Inc.; CompType: Resistor; Value: 0.007; Value_Code: 7L000; Tolerance_%: 1; Power_W: 3; TempCo: 100 ppm/C; EIA_Code: E96; U/M: EA; SymbolVersion: 2009-05-29; PartNumber: CRE2512-FZ-R007E-3; PackageReference: 2512; RoHS: Y; Res_ohm: 0.007; Value1: 1%; Value2: 3W; MountType: SMT; Technology: Thick Film; Published: 2008-06-26; Publisher: Texas Instruments; LatestRevisionDate: 2014-12-15; ComponentLink1Description: Datasheet link; ComponentLink1URL: http://media.digikey.com/pdf/Data%20Sheets/Rohm%20PDFs/PMR100-SERIES.pdf; Supplier 1: Digi-Key; Supplier Part Number 1: CRE2512-FZ-R007E-3CT-ND
R7 R9 R11 R32 = RC0603FR-074K99L: RES, 4.99 k, 1%, 0.1 W, 0603; Manufacturer: Yageo America; CompType: Resistor; Value: 4.99k; Res_ohm: 4990; Value_Code: 4k99; Tolerance_%: 1; Power_W: 0.1; Value2: 0.1W; VDC_V: 150; TempCo: 200 ppm/C; EIA_Code: E96; U/M: EA; SymbolVersion: 2009-05-29; PartNumber: RC0603FR-074K99L; PackageReference: 0603; RoHS: Y; Value1: 1%; MountType: SMT; Technology: Thick Film; Published: 2008-06-26; Publisher: Texas Instruments; LatestRevisionDate: 2014-12-16; ComponentLink1Description: Datasheet link; ComponentLink1URL: http://www.yageo.com/pdf/Pu-RC0603_51_PbFree_L_2.pdf; Supplier 1: Digi-Key; Supplier Part Number 1: 311-4.99KHRCT-ND; Supplier 2: Mouser; Supplier Part Number 2: 603-RC0603FR-074K99L; Supplier 3: Farnell; Supplier Part Number 3: 1799345
R12 = CRCW06031K50JNEA: RES, 1.5 k, 5%, 0.1 W, 0603; Manufacturer: Vishay-Dale; CompType: Resistor; Value: 1.5k; Res_ohm: 1500; Value_Code: 1k50; Tolerance_%: 5; Power_W: 0.1; Value2: 0.1W; VDC_V: 75; TempCo: 200 ppm/C; EIA_Code: E24; U/M: EA; AEC Category: Q200; SymbolVersion: 2009-05-29; PartNumber: CRCW06031K50JNEA; PackageReference: 0603; RoHS: Y; Value1: 5%; MountType: SMT; Technology: Thick Film; Published: 2008-06-26; Publisher: Texas Instruments; LatestRevisionDate: 2016-03-05; ComponentLink1Description: Datasheet link; ComponentLink1URL: http://www.vishay.com/docs/20035/dcrcwe3.pdf; Supplier 1: Digi-Key; Supplier Part Number 1: 541-1.5KGCT-ND; Supplier 2: Mouser; Supplier Part Number 2: 71-CRCW0603J-1.5K-E3; Supplier 3: Farnell; Supplier Part Number 3: 1531366; AEC Qualified: ?
R13-R15 R17 R36-R38 = CRCW06030000Z0EA: RES, 0, 5%, 0.1 W, 0603; Manufacturer: Vishay-Dale; CompType: Resistor; Value_Code: 0000; Tolerance_%: 5; Power_W: 0.1; Value2: 0.1W; VDC_V: 75; TempCo: 200 ppm/C; EIA_Code: E24; U/M: EA; AEC Category: Q200; SymbolVersion: 2009-05-29; PartNumber: CRCW06030000Z0EA; PackageReference: 0603; RoHS: Y; Res_ohm: 0; Value1: 5%; MountType: SMT; Technology: Thick Film; Published: 2008-06-26; Publisher: Texas Instruments; LatestRevisionDate: 2015-12-05; ComponentLink1Description: Datasheet link; ComponentLink1URL: http://www.vishay.com/docs/20035/dcrcwe3.pdf; Supplier 1: Digi-Key; Supplier Part Number 1: 541-0.0GCT-ND; Supplier 2: Mouser; Supplier Part Number 2: 71-CRCW0603-0-E3; Supplier 3: Farnell; Supplier Part Number 3: 1469739; ValueDisplayed: 0; AEC Qualified: ?
R18 R20 R21 = CRCW060356R0JNEA: RES, 56 ohm, 5%, 0.1W, 0603; Manufacturer: Vishay-Dale; CompType: Resistor; Value_Code: 56R0; Tolerance_%: 5; Power_W: 0.1; VDC_V: 75; TempCo: 200 ppm/C; EIA_Code: E24; U/M: EA; SymbolVersion: 2009-05-29; PartNumber: CRCW060356R0JNEA; PackageReference: 0603; RoHS: Y; Res_ohm: 56; Value1: 5%; Value2: 0.1W; MountType: SMT; Technology: Thick Film; Published: 2008-06-26; Publisher: Texas Instruments; LatestRevisionDate: 2014-01-08; ComponentLink1Description: Datasheet link; ComponentLink1URL: http://www.vishay.com/docs/20035/dcrcwe3.pdf; Supplier 1: Digi-Key; Supplier Part Number 1: 541-56GCT-ND; Supplier 2: Mouser; Supplier Part Number 2: 71-CRCW0603J-56-E3; Supplier 3: Farnell; Supplier Part Number 3: 1514781
R22 R23 = CRCW060347K0JNEA: RES, 47 k, 5%, 0.1 W, 0603; Manufacturer: Vishay-Dale; CompType: Resistor; Value: 47k; Res_ohm: 47000; Value_Code: 47k0; Tolerance_%: 5; Power_W: 0.1; Value2: 0.1W; VDC_V: 75; TempCo: 200 ppm/C; EIA_Code: E24; U/M: EA; AEC Category: Q200; SymbolVersion: 2009-05-29; PartNumber: CRCW060347K0JNEA; PackageReference: 0603; RoHS: Y; Value1: 5%; MountType: SMT; Technology: Thick Film; Published: 2008-06-26; Publisher: Texas Instruments; LatestRevisionDate: 2016-03-05; ComponentLink1Description: Datasheet link; ComponentLink1URL: http://www.vishay.com/docs/20035/dcrcwe3.pdf; Supplier 1: Digi-Key; Supplier Part Number 1: 541-47KGCT-ND; Supplier 2: Mouser; Supplier Part Number 2: 71-CRCW060347K0JNEA; Supplier 3: Farnell; Supplier Part Number 3: 1652881; AEC Qualified: ?
R24 R34 = CRCW0603330RJNEA: RES, 330 ohm, 5%, 0.1W, 0603; Manufacturer: Vishay-Dale; CompType: Resistor; Value_Code: 330R; Tolerance_%: 5; Power_W: 0.1; VDC_V: 75; TempCo: 200 ppm/C; EIA_Code: E24; U/M: EA; SymbolVersion: 2009-05-29; PartNumber: CRCW0603330RJNEA; PackageReference: 0603; RoHS: Y; Res_ohm: 330; Value1: 5%; Value2: 0.1W; MountType: SMT; Technology: Thick Film; Published: 2008-06-26; Publisher: Texas Instruments; LatestRevisionDate: 2013-10-22; ComponentLink1Description: Datasheet link; ComponentLink1URL: http://www.vishay.com/docs/20035/dcrcwe3.pdf; Supplier 1: Digi-Key; Supplier Part Number 1: 541-330GCT-ND; Supplier 2: Mouser; Supplier Part Number 2: 71-CRCW0603J-330-E3; Supplier 3: Farnell; Supplier Part Number 3: 1692522
R25 = CRCW060310K0JNEA: RES, 10 k, 5%, 0.1 W, 0603; Manufacturer: Vishay-Dale; CompType: Resistor; Value: 10k; Res_ohm: 10000; Value_Code: 10k0; Tolerance_%: 5; Power_W: 0.1; Value2: 0.1W; VDC_V: 75; TempCo: 200 ppm/C; EIA_Code: E24; U/M: EA; AEC Category: Q200; SymbolVersion: 2009-05-29; PartNumber: CRCW060310K0JNEA; PackageReference: 0603; RoHS: Y; Value1: 5%; MountType: SMT; Technology: Thick Film; Published: 2008-06-26; Publisher: Texas Instruments; LatestRevisionDate: 2016-03-05; ComponentLink1Description: Datasheet link; ComponentLink1URL: http://www.vishay.com/docs/20035/dcrcwe3.pdf; Supplier 1: Digi-Key; Supplier Part Number 1: 541-10KGCT-ND; Supplier 2: Mouser; Supplier Part Number 2: 71-CRCW0603J-10K-E3; Supplier 3: Farnell; Supplier Part Number 3: 1469749; AEC Qualified: ?
R26 = CRCW060328K0FKEA: RES, 28.0 k, 1%, 0.1 W, 0603; Manufacturer: Vishay-Dale; CompType: Resistor; Value: 28.0k; Res_ohm: 28000; Value_Code: 28k0; Tolerance_%: 1; Power_W: 0.1; Value2: 0.1W; VDC_V: 75; TempCo: 100 ppm/C; EIA_Code: E96; U/M: EA; AEC Category: Q200; SymbolVersion: 2009-05-29; PartNumber: CRCW060328K0FKEA; PackageReference: 0603; RoHS: Y; Value1: 1%; MountType: SMT; Technology: Thick Film; Published: 2008-06-26; Publisher: Texas Instruments; LatestRevisionDate: 2016-03-05; ComponentLink1Description: Datasheet link; ComponentLink1URL: http://www.vishay.com/docs/20035/dcrcwe3.pdf; Supplier 1: Digi-Key; Supplier Part Number 1: 541-28.0KHCT-ND; Supplier 2: Mouser; Supplier Part Number 2: 71-CRCW0603-28K-E3; Supplier 3: Farnell; Supplier Part Number 3: 1151883; AEC Qualified: ?
R27 = CRCW06038K45FKEA: RES, 8.45 k, 1%, 0.1 W, 0603; Manufacturer: Vishay-Dale; CompType: Resistor; Value: 8.45k; Res_ohm: 8450; Value_Code: 8k45; Tolerance_%: 1; Power_W: 0.1; Value2: 0.1W; VDC_V: 75; TempCo: 100 ppm/C; EIA_Code: E96; U/M: EA; AEC Category: Q200; SymbolVersion: 2009-05-29; PartNumber: CRCW06038K45FKEA; PackageReference: 0603; RoHS: Y; Value1: 1%; MountType: SMT; Technology: Thick Film; Published: 2008-06-26; Publisher: Texas Instruments; LatestRevisionDate: 2016-03-05; ComponentLink1Description: Datasheet link; ComponentLink1URL: http://www.vishay.com/docs/20035/dcrcwe3.pdf; Supplier 1: Digi-Key; Supplier Part Number 1: 541-8.45KHCT-ND; Supplier 2: Mouser; Supplier Part Number 2: 71-CRCW0603-8.45K-E3; Supplier 3: Farnell; Supplier Part Number 3: 1152135; AEC Qualified: ?
R29-R31 = CRCW06031K00JNEA: RES, 1.0 k, 5%, 0.1 W, 0603; Manufacturer: Vishay-Dale; CompType: Resistor; Value: 1.0k; Res_ohm: 1000; Value_Code: 1k00; Tolerance_%: 5; Power_W: 0.1; Value2: 0.1W; VDC_V: 75; TempCo: 200 ppm/C; EIA_Code: E24; U/M: EA; AEC Category: Q200; SymbolVersion: 2009-05-29; PartNumber: CRCW06031K00JNEA; PackageReference: 0603; RoHS: Y; Value1: 5%; MountType: SMT; Technology: Thick Film; Published: 2008-06-26; Publisher: Texas Instruments; LatestRevisionDate: 2016-03-05; ComponentLink1Description: Datasheet link; ComponentLink1URL: http://www.vishay.com/docs/20035/dcrcwe3.pdf; Supplier 1: Digi-Key; Supplier Part Number 1: 541-1.0KGCT-ND; Supplier 2: Mouser; Supplier Part Number 2: 71-CRCW0603J-1.0K-E3; Supplier 3: Farnell; Supplier Part Number 3: 1652851; AEC Qualified: ?
R33 = 3352T-1-503LF: Trimming Potentiometer, 50K, 0.5W, TH; Manufacturer: Bourns; Sim Note: Enter the Resistance value and the set point into parameter fields.; SymbolCreator: a0412235; CompType: Trimmer; SymbolVersion: 2012-12-27; PartNumber: 3352T-1-503LF; MountType: TH; ComponentLink1Description: Datasheet Link; ComponentLink1URL: http://www.bourns.com/data/global/PDFs/3352.pdf; RoHS: Y; PackageReference: 9.53x8.89mm; Publisher: Texas Instruments; LatestRevisionDate: 2015-12-17; Supplier 1: Digi-Key; Supplier Part Number 1: 3352T-503LF-ND; Supplier 2: Mouser; Supplier Part Number 2: 652-3352T-1-503LF; Supplier 3: Farnell; Supplier Part Number 3: 1106991
R35 = CRCW0603330RJNEA: RES, 330, 5%, 0.1 W, 0603; Manufacturer: Vishay-Dale; CompType: Resistor; Value_Code: 330R; Tolerance_%: 5; Power_W: 0.1; Value2: 0.1W; VDC_V: 75; TempCo: 200 ppm/C; EIA_Code: E24; U/M: EA; AEC Category: Q200; SymbolVersion: 2009-05-29; PartNumber: CRCW0603330RJNEA; PackageReference: 0603; RoHS: Y; Res_ohm: 330; Value1: 5%; MountType: SMT; Technology: Thick Film; Published: 2008-06-26; Publisher: Texas Instruments; LatestRevisionDate: 2015-12-05; ComponentLink1Description: Datasheet link; ComponentLink1URL: http://www.vishay.com/docs/20035/dcrcwe3.pdf; Supplier 1: Digi-Key; Supplier Part Number 1: 541-330GCT-ND; Supplier 2: Mouser; Supplier Part Number 2: 71-CRCW0603J-330-E3; Supplier 3: Farnell; Supplier Part Number 3: 1692522; ValueDisplayed: 330; AEC Qualified: ?
R39-R42 = RC0603FR-0735K7L: RES, 35.7 k, 1%, 0.1 W, 0603; Manufacturer: Yageo America; CompType: Resistor; Value: 35.7k; Res_ohm: 35700; Value_Code: 35k7; Tolerance_%: 1; Power_W: 0.1; Value2: 0.1W; VDC_V: 150; TempCo: 200 ppm/C; SizeArea_mm2: 1.28; SizeX_mm: 1.6; SizeY_mm: 0.8; EIA_Code: E96; U/M: EA; AEC Category: Q200; SymbolVersion: 2009-05-29; PartNumber: RC0603FR-0735K7L; PackageReference: 0603; RoHS: Y; Value1: 1%; MountType: SMT; Technology: Thick Film; SizeZ_mm: 1; Published: 2008-06-26; Publisher: Texas Instruments; LatestRevisionDate: 2016-06-29; ComponentLink1Description: Datasheet link; ComponentLink1URL: http://www.yageo.com/pdf/Pu-RC0603_51_PbFree_L_2.pdf; Supplier 1: Digi-Key; Supplier Part Number 1: 311-35.7KHRCT-ND; Supplier 2: Mouser; Supplier Part Number 2: 603-RC0603FR-0735K7L; AEC Qualified: ?
TP1-TP9 = 5002: Test Point, Miniature, White, TH; Manufacturer: Keystone; CompType: Test Point Loop; U/M: EA; SymbolVersion: 2008-04-04; PartNumber: 5002; PackageReference: White Miniature Testpoint; RoHS: Y; MountType: TH; ComponentLink1Description: Datasheet Link; ComponentLink1URL: http://www.keyelco.com/userAssets/file/M60-2p60.pdf; Value: White; Publisher: Texas Instruments; LatestRevisionDate: 2015-08-25; Supplier 1: Digi-Key; Supplier Part Number 1: 36-5002-ND; Supplier 2: Newark; Supplier Part Number 2: 82H9632
TP10 = D3082-05: 1mm Uninsulated Shorting Plug, 10.16mm spacing, TH; Manufacturer: Harwin; SymbolCreator: a0799628; CompType: Jumper Wire; SymbolVersion: 2014-05-16; PartNumber: D3082-05; PackageReference: Shorting Plug, 10.16mm spacing, TH; RoHS: Y; MountType: TH; ComponentLink1Description: Datasheet URL; ComponentLink1URL: http://cdn.harwin.com/pdfs/D3080-D3083.pdf; Publisher: Texas Instruments; LatestRevisionDate: 2015-12-21; Supplier 1: Digi-Key; Supplier Part Number 1: 952-1873-ND; Supplier 2: Mouser; Supplier Part Number 2: 855-D3082-05
U1 = DRV8323RSRGZR: 60-V Three-Phase Smart Gate Driver, RGZ0048B; Alternate PartNumber: DRV8323RSRGZT; Manufacturer: Texas Instruments; SymbolCreator: Altium; CompType: IC; U/M: EA; SymbolVersion: 2016-03-15; PartNumber: DRV8323RSRGZR; PackageReference: RGZ0048B; MountType: SMT; ComponentLink1Description: Datasheet Link; ComponentLink1URL: https://sps06.itg.ti.com/sites/KMS/crossdivteams/altium/docs/ComponentDatasheets/DRV832x_031016.pdf; RoHS: Y; Publisher: Texas Instruments; LatestRevisionDate: 2016-03-21; Alternate Manufacturer: Texas Instruments
U2-U4 = CSD88599Q5DC: 60 V Half-Bridge NexFE Power Block, DMM0022A (LSON-CLIP-27); Alternate PartNumber: CSD88599Q5DCT; Manufacturer: Texas Instruments; SymbolCreator: Altium; SizeArea_mm2: 30; SizeAreaWB_mm2: 56; SizeX_mm: 5; SizeY_mm: 6; SizeZ_mm: 1.05; CompType: IC; U/M: EA; SymbolVersion: 2016-08-25; PartNumber: CSD88599Q5DC; PackageReference: DMM0022A; PackageDescription: LSON-CLIP-27; MountType: SMT; ComponentLink1Description: Datasheet Link; ComponentLink1URL: https://sps06.itg.ti.com/sites/KMS/crossdivteams/altium/docs/ComponentDatasheets/CSD88599Q5DC.pdf; RoHS: Y; Publisher: Texas Instruments; LatestRevisionDate: 2016-12-06; Alternate Manufacturer: Texas Instruments